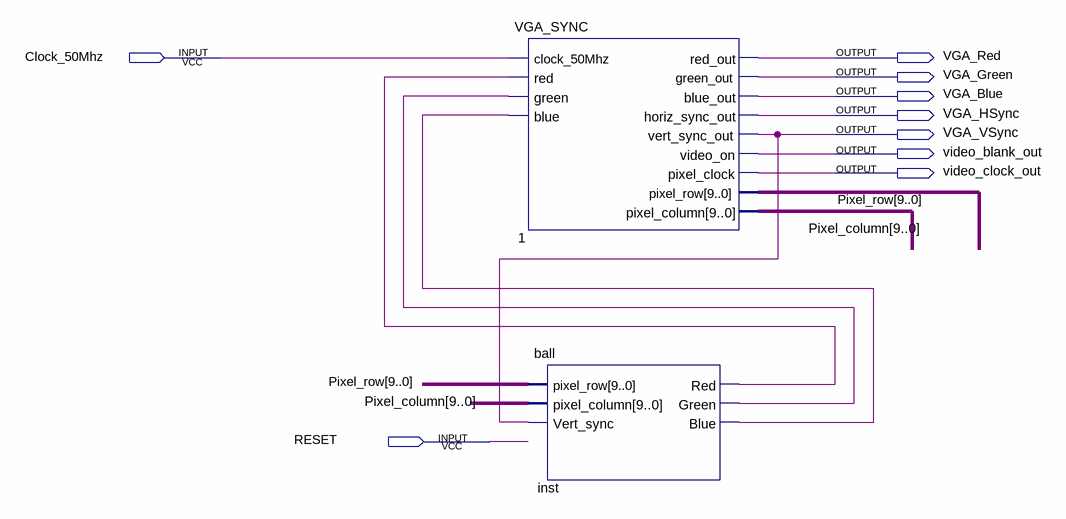
[diagram p0: schematic sheet]
// Quartus schematic VGA_BALL.bdf as structural Verilog: 2 symbols, 9 pins
module VGA_BALL (
  input  Clock_50Mhz,
  input  RESET,
  output VGA_Red,
  output VGA_Green,
  output VGA_Blue,
  output VGA_HSync,
  output VGA_VSync,
  output video_blank_out,
  output video_clock_out
);

  wire inst_blue, inst_green, inst_red;
  wire [9:0] Pixel_column, Pixel_row;

  VGA_SYNC u_1 (
    .red(inst_red), .green(inst_green), .blue(inst_blue), .clock_50Mhz(Clock_50Mhz), .red_out(VGA_Red),
    .green_out(VGA_Green), .blue_out(VGA_Blue), .horiz_sync_out(VGA_HSync), .vert_sync_out(VGA_VSync),
    .video_on(video_blank_out), .pixel_clock(video_clock_out), .pixel_row(Pixel_row),
    .pixel_column(Pixel_column));
  ball inst (
    .pixel_row(Pixel_row), .pixel_column(Pixel_column), .Vert_sync(VGA_VSync), .Red(inst_red),
    .Green(inst_green), .Blue(inst_blue));
endmodule
